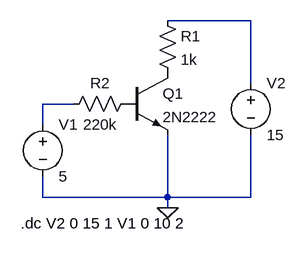
[diagram p0: schematic npnoutput.asc]
npnoutput.asc, the LTspice schematic file:
Version 4
SHEET 1 880 680
WIRE 320 16 192 16
WIRE 320 112 320 16
WIRE 48 144 0 144
WIRE 0 176 0 144
WIRE 0 288 0 256
WIRE 192 288 192 192
WIRE 192 288 0 288
WIRE 320 288 320 192
WIRE 320 288 192 288
WIRE 192 304 192 288
FLAG 192 304 0
SYMBOL npn 128 96 R0
SYMATTR InstName Q1
SYMATTR Value 2N2222
SYMBOL res 176 0 R0
SYMATTR InstName R1
SYMATTR Value 1k
SYMBOL res 144 128 R90
WINDOW 0 0 56 VBottom 2
WINDOW 3 32 56 VTop 2
SYMATTR InstName R2
SYMATTR Value 220k
SYMBOL voltage 0 160 R0
WINDOW 123 0 0 Left 0
WINDOW 39 0 0 Left 0
SYMATTR InstName V1
SYMATTR Value 5
SYMBOL voltage 320 96 R0
WINDOW 123 0 0 Left 0
WINDOW 39 0 0 Left 0
SYMATTR InstName V2
SYMATTR Value 15
TEXT -34 328 Left 2 !.dc V2 0 15 1 V1 0 10 2

The netlist it stands for:
* npnoutput.asc
Q1 P001 P002 0 0 2N2222
R1 N001 P001 1k
R2 P002 N002 220k
V1 N002 0 5
V2 N001 0 15
.model NPN NPN
.model PNP PNP
.lib standard.bjt
.dc V2 0 15 1 V1 0 10 2
.backanno
.end